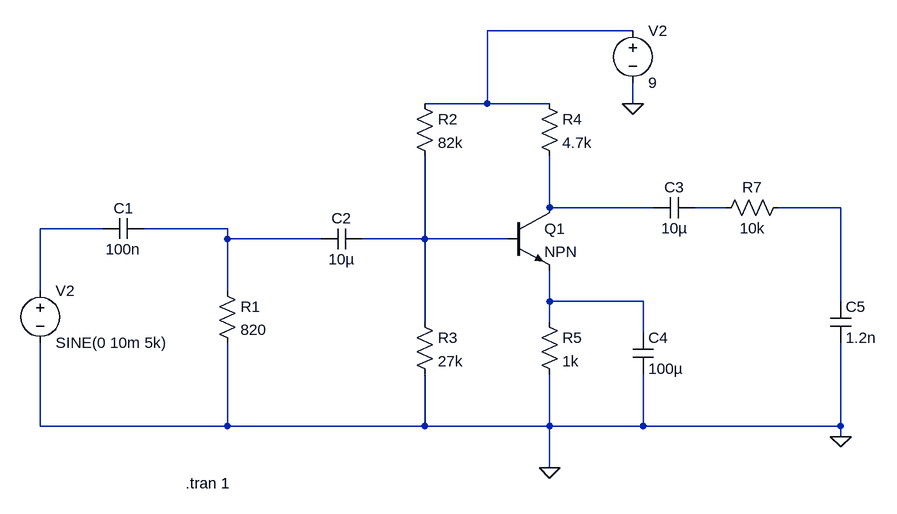
[diagram p0: schematic AE Final Project.asc]
AE Final Project.asc, the LTspice schematic file:
Version 4.1
SHEET 1 1060 680
WIRE 576 -192 352 -192
WIRE 352 -80 352 -192
WIRE 352 -80 256 -80
WIRE 448 -80 352 -80
WIRE 576 -80 576 -112
WIRE 448 80 448 0
WIRE 608 80 448 80
WIRE 720 80 672 80
WIRE 896 80 800 80
WIRE -240 112 -336 112
WIRE -48 112 -176 112
WIRE -48 128 -48 112
WIRE 96 128 -48 128
WIRE 256 128 256 0
WIRE 256 128 160 128
WIRE 384 128 256 128
WIRE -336 208 -336 112
WIRE -48 208 -48 128
WIRE 448 224 448 176
WIRE 592 224 448 224
WIRE 896 224 896 80
WIRE 256 256 256 128
WIRE 448 256 448 224
WIRE 592 272 592 224
WIRE -336 416 -336 288
WIRE -48 416 -48 288
WIRE -48 416 -336 416
WIRE 256 416 256 336
WIRE 256 416 -48 416
WIRE 448 416 448 336
WIRE 448 416 256 416
WIRE 592 416 592 336
WIRE 592 416 448 416
WIRE 896 416 896 288
WIRE 896 416 592 416
WIRE 896 432 896 416
WIRE 448 480 448 416
FLAG 576 -80 0
FLAG 448 480 0
FLAG 896 432 0
SYMBOL voltage -336 192 R0
SYMATTR InstName V2
SYMATTR Value SINE(0 10m 5k)
SYMBOL cap -176 96 R90
WINDOW 0 0 32 VBottom 2
WINDOW 3 32 32 VTop 2
SYMATTR InstName C1
SYMATTR Value 100n
SYMBOL res 240 -96 R0
SYMATTR InstName R2
SYMATTR Value 82k
SYMBOL res 240 240 R0
SYMATTR InstName R3
SYMATTR Value 27k
SYMBOL res 432 -96 R0
SYMATTR InstName R4
SYMATTR Value 4.7k
SYMBOL npn 384 80 R0
SYMATTR InstName Q1
SYMBOL res 432 240 R0
SYMATTR InstName R5
SYMATTR Value 1k
SYMBOL cap 672 64 R90
WINDOW 0 0 32 VBottom 2
WINDOW 3 32 32 VTop 2
SYMATTR InstName C3
SYMATTR Value 10µ
SYMBOL cap 576 272 R0
SYMATTR InstName C4
SYMATTR Value 100µ
SYMBOL voltage 576 -208 R0
WINDOW 123 0 0 Left 0
WINDOW 39 0 0 Left 0
SYMATTR InstName V2
SYMATTR Value 9
SYMBOL cap 160 112 R90
WINDOW 0 0 32 VBottom 2
WINDOW 3 32 32 VTop 2
SYMATTR InstName C2
SYMATTR Value 10µ
SYMBOL res -64 192 R0
SYMATTR InstName R1
SYMATTR Value 820
SYMBOL res 816 64 R90
WINDOW 0 0 56 VBottom 2
WINDOW 3 32 56 VTop 2
SYMATTR InstName R7
SYMATTR Value 10k
SYMBOL cap 880 224 R0
SYMATTR InstName C5
SYMATTR Value 1.2n
TEXT -112 504 Left 2 !.tran 1

The netlist it stands for:
* AE Final Project.asc
V2 N005 0 SINE(0 10m 5k)
C1 N006 N005 100n
R2 N001 N007 82k
R3 N007 0 27k
R4 N001 N002 4.7k
Q1 N002 N007 N008 0 NPN
R5 N008 0 1k
C3 N003 N002 10µ
C4 N008 0 100µ
V2 N001 0 9
C2 N007 N006 10µ
R1 N006 0 820
R7 N004 N003 10k
C5 N004 0 1.2n
.model NPN NPN
.model PNP PNP
.lib standard.bjt
.tran 1
.backanno
.end